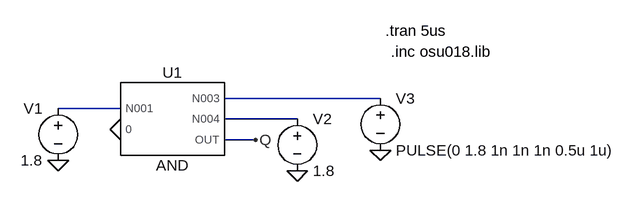
[diagram p0: schematic AND_test.asc]
AND_test.asc, the LTspice schematic file:
Version 4
SHEET 1 880 680
WIRE 416 144 176 144
WIRE 16 160 -80 160
WIRE 288 176 176 176
WIRE 224 208 176 208
FLAG 288 256 0
FLAG 416 224 0
FLAG -80 240 0
FLAG 16 192 0
FLAG 224 208 Q
SYMBOL voltage -80 144 M0
WINDOW 123 0 0 Left 0
WINDOW 39 0 0 Left 0
SYMATTR InstName V1
SYMATTR Value 1.8
SYMBOL voltage 288 160 R0
WINDOW 123 0 0 Left 0
WINDOW 39 0 0 Left 0
SYMATTR InstName V2
SYMATTR Value 1.8
SYMBOL voltage 416 128 R0
WINDOW 123 0 0 Left 0
WINDOW 39 0 0 Left 0
SYMATTR InstName V3
SYMATTR Value PULSE(0 1.8 1n 1n 1n 0.5u 1u)
SYMBOL AND_new 96 176 R0
SYMATTR InstName U1
TEXT 424 40 Left 2 !.tran 5us
TEXT 432 72 Left 2 !.inc osu018.lib

The netlist it stands for:
* AND_test.asc
V1 N002 0 1.8
V2 N003 0 1.8
V3 N001 0 PULSE(0 1.8 1n 1n 1n 0.5u 1u)
XU1 N002 0 N001 N003 Q AND  ; pins N001 0 N003 N004 OUT
.tran 5us
.inc osu018.lib
.lib C:\Users\ananya\Documents\LTspiceXVII\ADC.cir
.backanno
.end